# EAGLE board C10450-01 (EAGLE 6.6.0), part 1 of 2
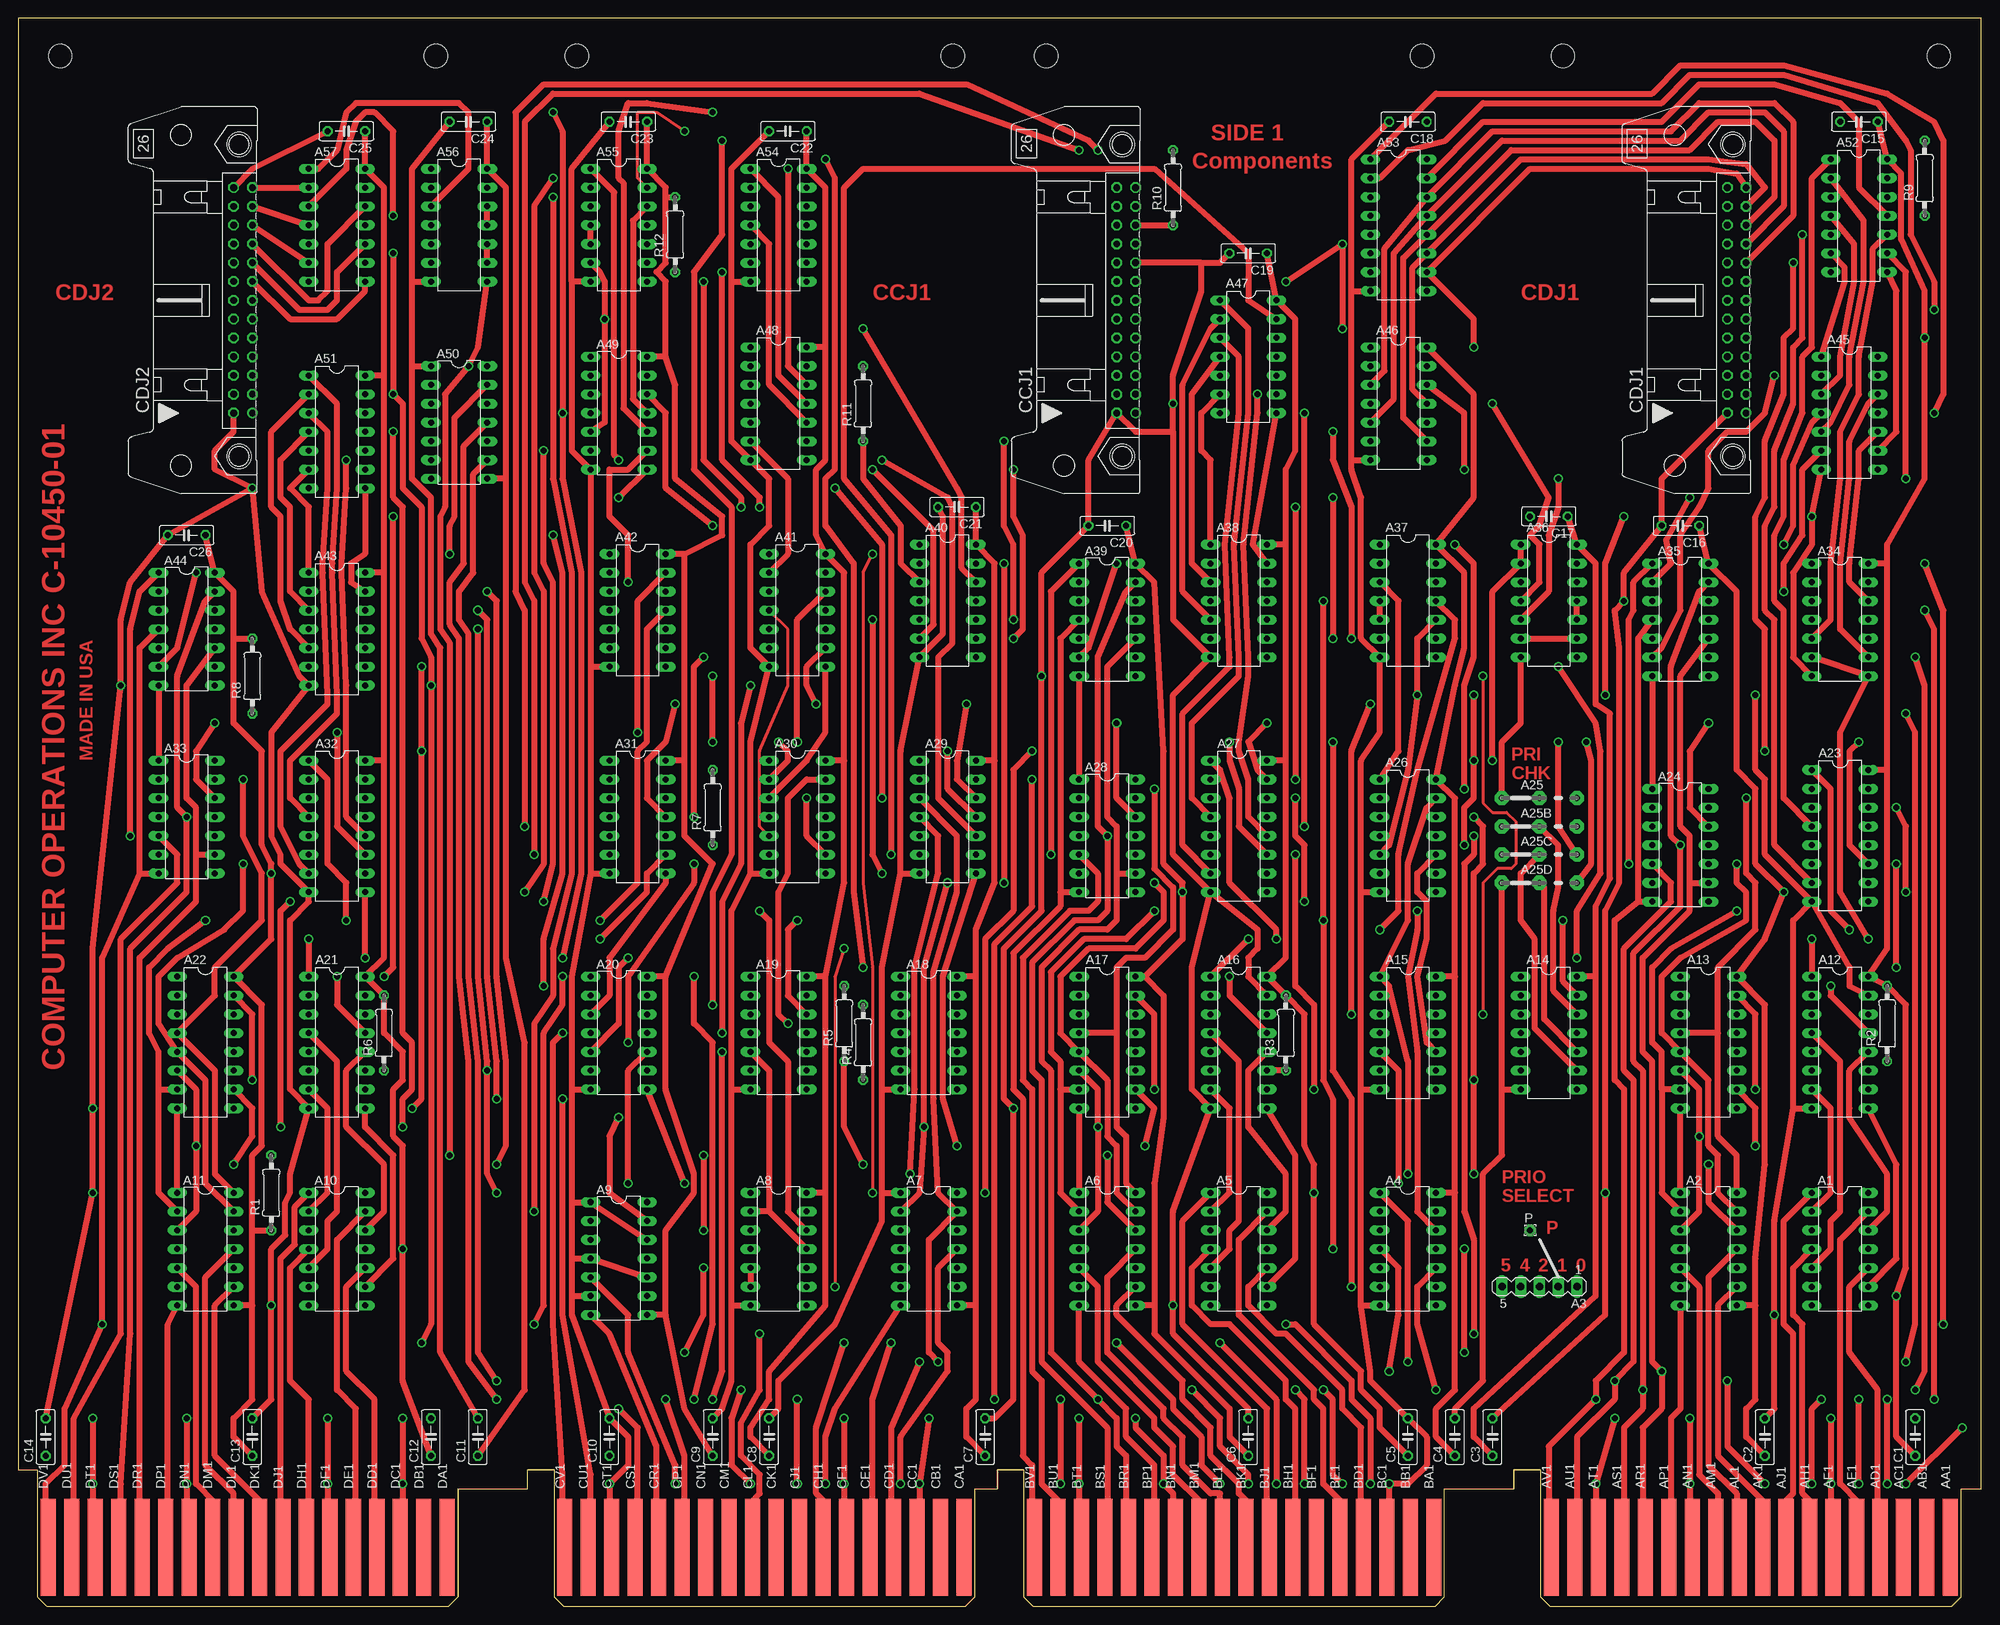
[diagram p3: board, top side]
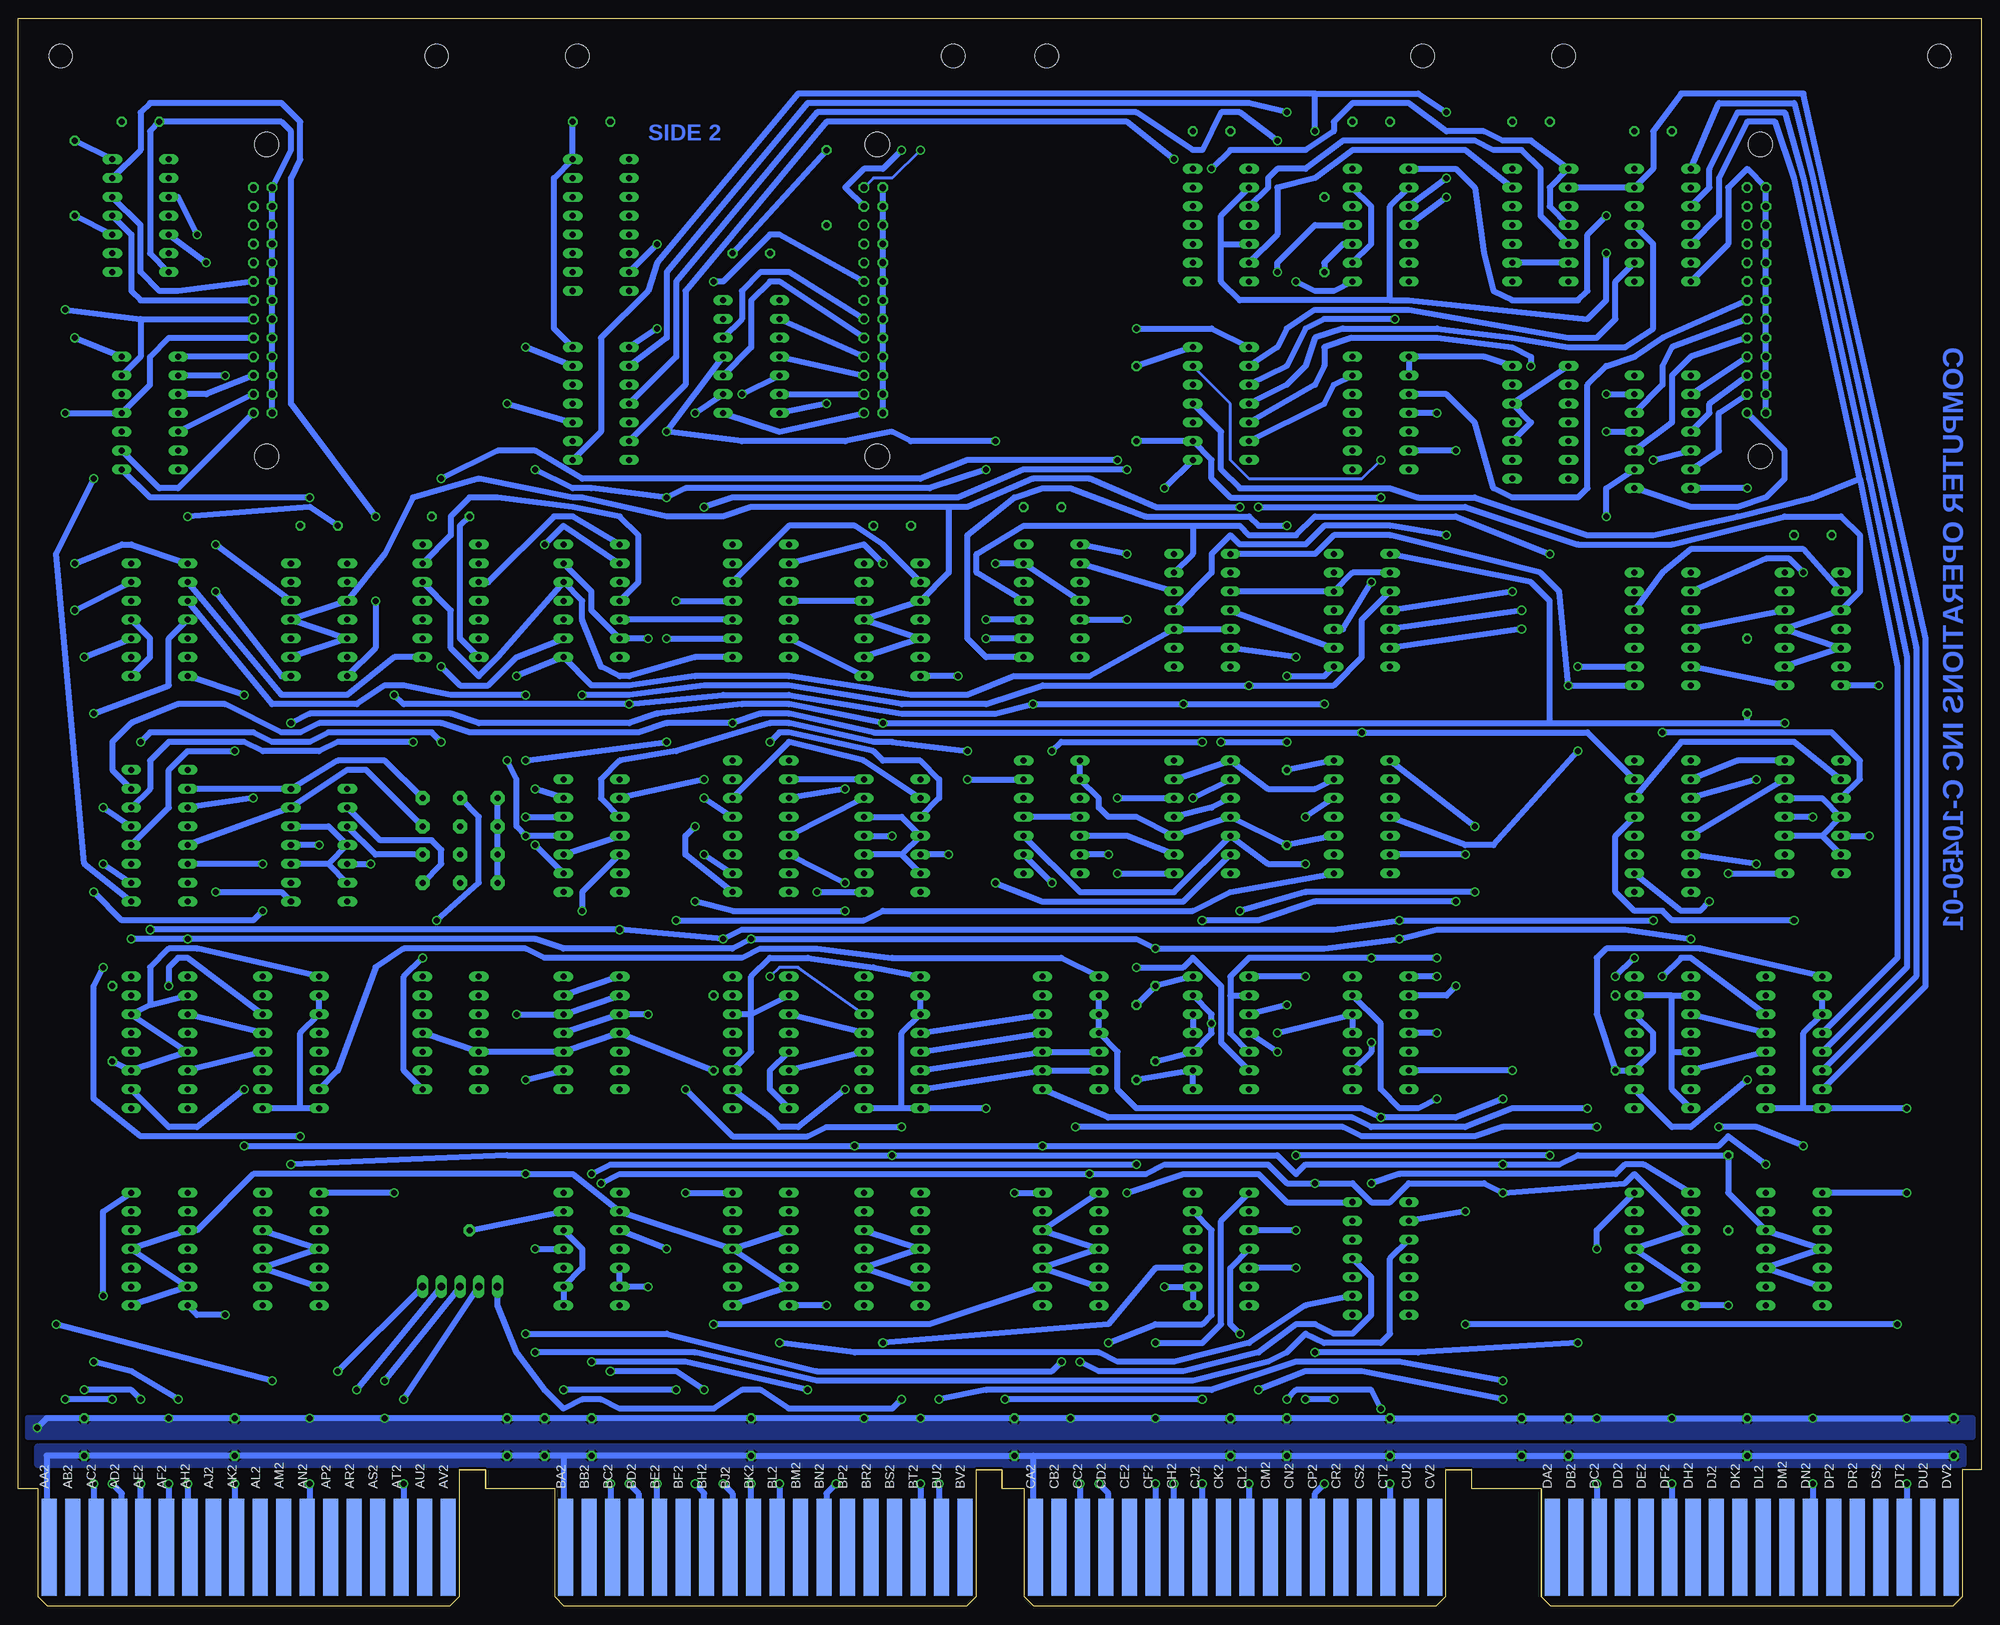
[diagram p4: board, bottom side, seen from below]

Size 265.3 x 214.63 mm. Coordinates in mm from the lower left corner, seen from the top.
Copper layers (1+2+16): Top 0.035mm / dielectric 1.5mm / Route2 0.035mm / dielectric 0.15mm / Bottom 0.035mm
Design rules "16mils": minimum track width 16mil, minimum drill 32mil, track to track 15mil, track to pad 10mil, pad to pad 10mil, via to via 10mil, smd to smd 10mil, copper to edge 13mil, drill to drill 10mil, minimum pad ring 10mil, minimum via ring 8mil, stop-mask expansion 0mil, vias tented up to drill 0mil, thermal gap 10mil
Net classes: 1 supply: width 0.813 mm

## Footprints (pad centres in the part's own frame; a part is rotated, then mirrored left to right if it is on the bottom)
DIL14 = drill 0.813 long: 1 -7.62,-3.81; 2 -5.08,-3.81; 3 -2.54,-3.81; 4 0,-3.81; 5 2.54,-3.81; 6 5.08,-3.81; 7 7.62,-3.81; 8 7.62,3.81; 9 5.08,3.81; 10 2.54,3.81; 11 0,3.81; 12 -2.54,3.81; 13 -5.08,3.81; 14 -7.62,3.81
MA05-1 = drill 1.016 long: 1 -5.08,0; 2 -2.54,0; 3 0,0; 4 2.54,0; 5 5.08,0
DIL16 = drill 0.813 long: 1 -8.89,-3.81; 2 -6.35,-3.81; 3 -3.81,-3.81; 4 -1.27,-3.81; 5 1.27,-3.81; 6 3.81,-3.81; 7 6.35,-3.81; 8 8.89,-3.81; 9 8.89,3.81; 10 6.35,3.81; 11 3.81,3.81; 12 1.27,3.81; 13 -1.27,3.81; 14 -3.81,3.81; 15 -6.35,3.81; 16 -8.89,3.81
05C = drill 0.813 pad 1.905 octagon: 1 -2.54,0; 2 2.54,0; 3 7.62,0
C050-025X075 = drill 0.813 octagon: 1 -2.54,0; 2 2.54,0
26H = drill 0.914: 1 -15.24,-1.27 | drill 0.914 octagon: 2 -15.24,1.27; 3 -12.7,-1.27; 4 -12.7,1.27; 5 -10.16,-1.27; 6 -10.16,1.27; 7 -7.62,-1.27; 8 -7.62,1.27; 9 -5.08,-1.27; 10 -5.08,1.27; 11 -2.54,-1.27; 12 -2.54,1.27; 13 0,-1.27; 14 0,1.27; 15 2.54,-1.27; 16 2.54,1.27; 17 5.08,-1.27; 18 5.08,1.27; 19 7.62,-1.27; 20 7.62,1.27; 21 10.16,-1.27; 22 10.16,1.27; 23 12.7,-1.27; 24 12.7,1.27; 25 15.24,-1.27; 26 15.24,1.27 | hole 3.302: -21.082,0.533; 21.082,0.533
1,6/0,8 = drill 0.813 pad 1.6 octagon: 1 0,0
0207/10 = drill 0.813 octagon: 1 -5.08,0; 2 5.08,0
OMNIBUS = hole 3.175: 208.915,209.55; 259.715,209.55; 189.865,209.55; 139.065,209.55; 75.616,209.55; 126.416,209.55; 56.566,209.55; 5.766,209.55
EDGE-CON8 = smd 2.032 x 13.106: AA1 261.303,7.938; AB1 258.127,7.938; AC1 254.952,7.938; AD1 251.778,7.938; AE1 248.602,7.938; AF1 245.428,7.938; AH1 242.252,7.938; AJ1 239.077,7.938; AK1 235.903,7.938; AL1 232.727,7.938; AM1 229.553,7.938; AN1 226.377,7.938; AP1 223.202,7.938; AR1 220.028,7.938; AS1 216.852,7.938; AT1 213.678,7.938; AU1 210.502,7.938; AV1 207.327,7.938; BA1 191.452,7.938; BB1 188.278,7.938; BC1 185.102,7.938; BD1 181.928,7.938; BE1 178.752,7.938; BF1 175.577,7.938; BH1 172.403,7.938; BJ1 169.227,7.938; BK1 166.053,7.938; BL1 162.877,7.938; BM1 159.702,7.938; BN1 156.528,7.938; BP1 153.352,7.938; BR1 150.178,7.938; BS1 147.002,7.938; BT1 143.827,7.938; BU1 140.653,7.938; BV1 137.477,7.938; CA1 127.953,7.938; CB1 124.778,7.938; CC1 121.603,7.938; CD1 118.427,7.938; CE1 115.252,7.938; CF1 112.078,7.938; CH1 108.903,7.938; CJ1 105.728,7.938; CK1 102.552,7.938; CL1 99.377,7.938; CM1 96.203,7.938; CN1 93.028,7.938; CP1 89.853,7.938; CR1 86.677,7.938; CS1 83.502,7.938; CT1 80.328,7.938; CU1 77.153,7.938; CV1 73.978,7.938; DA1 58.102,7.938; DB1 54.928,7.938; DC1 51.752,7.938; DD1 48.578,7.938; DE1 45.403,7.938; DF1 42.227,7.938; DH1 39.053,7.938; DJ1 35.877,7.938; DK1 32.703,7.938; DL1 29.527,7.938; DM1 26.352,7.938; DN1 23.177,7.938; DP1 20.003,7.938; DR1 16.828,7.938; DS1 13.652,7.938; DT1 10.477,7.938; DU1 7.303,7.938; DV1 4.128,7.938 | smd 2.032 x 13.106 bottom: AA2 261.303,7.938; AB2 258.127,7.938; AC2 254.952,7.938; AD2 251.778,7.938; AE2 248.602,7.938; AF2 245.428,7.938; AH2 242.252,7.938; AJ2 239.077,7.938; AK2 235.903,7.938; AL2 232.727,7.938; AM2 229.553,7.938; AN2 226.377,7.938; AP2 223.202,7.938; AR2 220.028,7.938; AS2 216.852,7.938; AT2 213.678,7.938; AU2 210.502,7.938; AV2 207.327,7.938; BA2 191.452,7.938; BB2 188.278,7.938; BC2 185.102,7.938; BD2 181.928,7.938; BE2 178.752,7.938; BF2 175.577,7.938; BH2 172.403,7.938; BJ2 169.227,7.938; BK2 166.053,7.938; BL2 162.877,7.938; BM2 159.702,7.938; BN2 156.528,7.938; BP2 153.352,7.938; BR2 150.178,7.938; BS2 147.002,7.938; BT2 143.827,7.938; BU2 140.653,7.938; BV2 137.477,7.938; CA2 127.953,7.938; CB2 124.778,7.938; CC2 121.603,7.938; CD2 118.427,7.938; CE2 115.252,7.938; CF2 112.078,7.938; CH2 108.903,7.938; CJ2 105.728,7.938; CK2 102.552,7.938; CL2 99.377,7.938; CM2 96.203,7.938; CN2 93.028,7.938; CP2 89.853,7.938; CR2 86.677,7.938; CS2 83.502,7.938; CT2 80.328,7.938; CU2 77.153,7.938; CV2 73.978,7.938; DA2 58.102,7.938; DB2 54.928,7.938; DC2 51.752,7.938; DD2 48.578,7.938; DE2 45.403,7.938; DF2 42.227,7.938; DH2 39.053,7.938; DJ2 35.877,7.938; DK2 32.703,7.938; DL2 29.527,7.938; DM2 26.352,7.938; DN2 23.177,7.938; DP2 20.003,7.938; DR2 16.828,7.938; DS2 13.652,7.938; DT2 10.477,7.938; DU2 7.303,7.938; DV2 4.128,7.938

## Placement (x,y rotation side)
A1  N8881N  [DIL14]  246.25,48.26 270 top
A2  SP380N  [DIL14]  228.47,48.26 270 top
A3  [MA05-1]  205.61,43.18 180 top
A4  N8881N  [DIL14]  187.83,48.26 270 top
A5  N8881N  [DIL14]  164.97,48.26 270 top
A6  SP380N  [DIL14]  147.19,48.26 270 top
A7  SP384N  [DIL14]  123.06,48.26 270 top
A8  N8881N  [DIL14]  102.74,48.26 270 top
A9  SP380N  [DIL14]  81.15,46.99 270 top
A10  N8881N  [DIL14]  43.05,48.26 270 top
A11  SP380N  [DIL14]  25.27,48.26 270 top
A12  74157N  [DIL16]  246.25,76.2 270 top
A13  74195N  [DIL16]  228.47,76.2 270 top
A14  N8815  [DIL14]  206.88,77.47 270 top
A15  74S74N  [DIL14]  187.83,77.47 270 top
A16  74157N  [DIL16]  164.97,76.2 270 top
A17  74195N  [DIL16]  147.19,76.2 270 top
A18  7430N  [DIL14]  123.06,77.47 270 top
A19  N8881N  [DIL14]  102.74,77.47 270 top
A20  N8881N  [DIL14]  81.15,77.47 270 top
A21  74157N  [DIL16]  43.05,76.2 270 top
A22  74195N  [DIL16]  25.27,76.2 270 top
A23  74157N  [DIL16]  246.25,104.14 270 top
A24  SP380N  [DIL14]  224.66,102.87 270 top
A25  [05C]  203.07,109.22 0 top
A25B  [05C]  203.07,105.41 0 top
A25C  [05C]  203.07,101.6 0 top
A25D  [05C]  203.07,97.79 0 top
A26  7474N  [DIL14]  187.83,104.14 270 top
A27  74157N  [DIL16]  164.97,105.41 270 top
A28  SP380N  [DIL14]  147.19,104.14 270 top
A29  74S11N  [DIL14]  125.6,106.68 270 top
A30  7474N  [DIL14]  105.28,106.68 270 top
A31  74S74N  [DIL14]  83.69,106.68 270 top
A32  74157N  [DIL16]  43.05,105.41 270 top
A33  SP380N  [DIL14]  22.73,106.68 270 top
A34  N8881N  [DIL14]  246.25,133.35 270 top
A35  N8881N  [DIL14]  224.66,133.35 270 top
A36  9002  [DIL14]  206.88,135.89 270 top
A37  7408N  [DIL14]  187.83,135.89 270 top
A38  7404N  [DIL14]  164.97,135.89 270 top
A39  N8881N  [DIL14]  147.19,133.35 270 top
A40  7410N  [DIL14]  125.6,135.89 270 top
A41  7408N  [DIL14]  105.28,134.62 270 top
A42  7402N  [DIL14]  83.69,134.62 270 top
A43  7404N  [DIL14]  43.05,132.08 270 top
A44  N8881N  [DIL14]  22.73,132.08 270 top
A45  7404N  [DIL14]  247.52,161.29 270 top
A46  7404N  [DIL14]  186.56,162.56 270 top
A47  7406N  [DIL14]  166.24,168.91 270 top
A48  7404N  [DIL14]  102.74,162.56 270 top
A49  7438N  [DIL14]  81.15,161.29 270 top
A50  SP380N  [DIL14]  59.56,160.02 270 top
A51  7406N  [DIL14]  43.05,158.75 270 top
A52  7406N  [DIL14]  248.79,187.96 270 top
A53  220/330  [DIL16]  186.56,186.69 270 top
A54  7408N  [DIL14]  102.74,186.69 270 top
A55  7408N  [DIL14]  81.15,186.69 270 top
A56  7410N  [DIL14]  59.56,186.69 270 top
A57  7406N  [DIL14]  43.05,186.69 270 top
C1  .01uF  [C050-025X075]  256.41,22.86 90 top
C2  .01uF  [C050-025X075]  236.09,22.86 90 top
C3  .01uF  [C050-025X075]  199.26,22.86 90 top
C4  .01uF  [C050-025X075]  194.18,22.86 90 top
C5  .01uF  [C050-025X075]  187.83,22.86 90 top
C6  .01uF  [C050-025X075]  166.24,22.86 90 top
C7  .01uF  [C050-025X075]  130.68,22.86 90 top
C8  .01uF  [C050-025X075]  101.47,22.86 90 top
C9  .01uF  [C050-025X075]  93.85,22.86 90 top
C10  .01uF  [C050-025X075]  79.88,22.86 90 top
C11  .01uF  [C050-025X075]  62.1,22.86 90 top
C12  .01uF  [C050-025X075]  55.75,22.86 90 top
C13  .01uF  [C050-025X075]  31.62,22.86 90 top
C14  .01uF  [C050-025X075]  3.68,22.86 90 top
C15  .01uF  [C050-025X075]  248.79,200.66 180 top
C16  .01uF  [C050-025X075]  224.66,146.05 180 top
C17  .01uF  [C050-025X075]  206.88,147.32 180 top
C18  .01uF  [C050-025X075]  187.83,200.66 180 top
C19  .01uF  [C050-025X075]  166.24,182.88 180 top
C20  .01uF  [C050-025X075]  147.19,146.05 180 top
C21  .01uF  [C050-025X075]  126.87,148.59 180 top
C22  .01uF  [C050-025X075]  104.01,199.39 180 top
C23  .01uF  [C050-025X075]  82.42,200.66 180 top
C24  .01uF  [C050-025X075]  60.83,200.66 180 top
C25  .01uF  [C050-025X075]  44.32,199.39 180 top
C26  .01uF  [C050-025X075]  22.73,144.78 180 top
CCJ1  [26H]  149.73,176.53 90 top
CDJ1  [26H]  232.28,176.53 90 top
CDJ2  [26H]  30.35,176.53 90 top
P  [1,6/0,8]  204.34,50.8 0 top
R1  390  [0207/10]  34.16,55.88 90 top
R2  1K  [0207/10]  252.6,78.74 90 top
R3  1K  [0207/10]  171.32,77.47 90 top
R4  1K  [0207/10]  114.17,76.2 90 top
R5  1K  [0207/10]  111.63,78.74 90 top
R6  1K  [0207/10]  49.4,77.47 90 top
R7  1K  [0207/10]  93.85,107.95 90 top
R8  390  [0207/10]  31.62,125.73 90 top
R9  1K  [0207/10]  257.68,193.04 90 top
R10  1K  [0207/10]  156.08,191.77 90 top
R11  1K  [0207/10]  114.17,162.56 90 top
R12  1K  [0207/10]  88.77,185.42 90 top
U$1  OUTLINE-OMNIBUS  [OMNIBUS]  -0.13,0 0 top
U$2  [EDGE-CON8]  -0.13,0 0 top

## Tracks (layer width: path | path; a pad name or v marks a point on that pad's centre or on a via)
!(676[13]+677[23])
  Top 0.813: A48.6 104.01,152.4 104.01,142.24 A41.2
  Bottom 0.813: A49.13 87.5,165.1 88.77,162.56 A48.6
!BINITIALIZE  (via drill 0.81)
  Top 0.813: A55.6 78.61,180.34 79.25,179.07 v79.25,173.99 79.25,160.02 A49.5
  Bottom 0.813: v79.25,173.99 88.77,173.99 91.31,172.72 93.85,167.64 A48.3
!BREAK_CYCLE  (via drill 0.81)
  Top 0.813: v162.43,16.51 159.89,19.05 159.89,22.86 156.08,26.67 156.08,27.94 v148.46,35.56
  Bottom 0.813: U$2.BL2 162.43,8.26 v162.43,16.51 | A8.10 111.63,45.72 117.98,38.1 v148.46,35.56
!BRK_DATA_CONT  (via drill 0.81)
  Top 0.813: v166.24,16.51 166.24,17.78 162.43,21.59 162.43,25.4 v158.62,29.21 | A4.1 187.83,52.07 v187.83,33.02
  Bottom 0.813: U$2.BK2 166.24,8.26 v166.24,16.51 | v187.83,33.02 175.13,33.02 v158.62,29.21
!BRK_IN_PROG  (via drill 0.81)
  Top 0.813: v191.64,29.21 189.1,38.1 189.1,43.18 A4.10 | v176.4,29.21 177.67,27.94 177.67,17.78 v178.94,16.51
  Bottom 0.813: v176.4,29.21 v191.64,29.21 | v178.94,16.51 178.94,8.26 U$2.BE2
!C0  (via drill 0.81)
  Top 0.813: U$2.CE1 115.44,8.26 115.44,27.94 v117.98,35.56
  Bottom 0.813: A8.13 104.01,50.8 104.01,39.37 105.28,38.1 111.63,38.1 v117.98,35.56
!C1  (via drill 0.81)
  Top 0.813: U$2.CH1 109.09,8.26 109.09,13.97 107.82,15.24 107.82,24.13 v111.63,35.56
  Bottom 0.813: A8.1 102.74,52.07 102.74,38.1 105.28,35.56 v111.63,35.56
!CA  (via drill 0.81)
  Top 0.813: v133.22,140.97 v133.22,97.79
  Bottom 0.813: A30.6 107.82,95.25 126.87,95.25 v133.22,97.79 | v133.22,140.97 A40.13 A40.4
!CDJ1P25  (via drill 0.81)
  Top 0.813: v134.49,130.81 135.76,132.08 135.76,144.78 134.49,147.32 v134.49,153.67 | A46.12 195.45,161.29 v195.45,153.67 | v177.67,149.86 v177.67,130.81
  Bottom 0.813: v195.45,153.67 190.37,151.13 187.83,151.13 v177.67,149.86 175.13,151.13 142.11,151.13 v134.49,153.67 | A40.9 v134.49,130.81 | v177.67,130.81 A38.9
!CPMA_DISABLE  (via drill 0.81)
  Top 0.813: U$2.CU1 77.34,8.26 77.34,17.78 73.53,39.37 v73.53,68.58
  Bottom 0.813: A20.13 81.15,78.74 81.15,69.85 78.61,67.31 76.07,67.31 v73.53,68.58
!DATA0  (via drill 0.81)
  Top 0.813: U$2.AR1 219.58,8.26 219.58,24.13 222.12,26.67 v222.12,31.75 220.85,33.02 220.85,73.66 219.58,74.93 219.58,87.63 225.93,93.98 225.93,97.79 | 225.93,97.79 A24.9 | A35.10 224.66,125.73 224.66,105.41 225.93,104.14 225.93,97.79
  Bottom 0.813: A3.1 v222.12,31.75
!DATA1  (via drill 0.81)
  Top 0.813: A35.13 227.2,137.16 223.39,127 223.39,104.14 v224.66,102.87 224.66,94.61 218.31,88.27 218.31,73.66 219.58,72.39 v219.58,29.21 219.58,26.67 217.04,24.13 217.04,8.26 U$2.AS1
  Bottom 0.813: v219.58,29.21 A3.2 | v224.66,102.87 A24.11
!DATA2  (via drill 0.81)
  Top 0.813: U$2.AU1 210.69,8.26 210.69,22.86 215.77,27.94 v215.77,30.48 218.31,33.02 218.31,71.12 217.04,72.39 217.04,88.9 223.39,95.25 223.39,97.79 A24.5 | A35.1 218.31,138.43 218.31,134.62 217.68,133.35 v217.68,100.33
  Bottom 0.813: v215.77,30.48 A3.3 | A24.5 v217.68,100.33
!DATA3  (via drill 0.81)
  Top 0.813: U$2.AV1 206.88,8.26 206.88,21.59 v213.23,27.94 213.23,30.48 217.04,34.29 217.04,69.85 215.77,71.12 215.77,92.71 218.95,95.25 | A24.7 219.58,95.25 218.95,95.25 | A35.4 218.95,130.81 218.95,95.25
  Bottom 0.813: v213.23,27.94 A3.4
!DATA4  (via drill 0.81)
  Top 0.813: U$2.BR1 149.73,8.26 149.73,20.32 148.46,21.59 148.46,25.4 v145.92,27.94 139.57,34.29 139.57,72.39 138.3,73.66 138.3,86.36 143.38,91.44 147.19,91.44 148.46,92.71 148.46,99.06 | 148.46,99.06 A28.9 | 148.46,99.06 148.46,105.41 147.19,106.68 147.19,127 A39.10
  Bottom 0.813: A3.5 200.53,40.64 197.99,34.29 194.18,29.21 191.64,26.67 189.1,27.94 186.56,27.94 184.02,26.67 171.32,26.67 167.51,29.21 164.97,29.21 161.16,26.67 147.19,26.67 v145.92,27.94
!DATA5  (via drill 0.81)
  Top 0.813: U$2.BS1 147.19,8.26 147.19,24.13 138.3,33.02 138.3,71.12 137.03,72.39 137.03,87 142.75,92.71 145.92,92.71 147.19,93.98 v147.19,104.14 145.92,105.41 145.92,128.27 149.73,137.16 A39.13
  Bottom 0.813: A28.11 v147.19,104.14
!DATA6  (via drill 0.81)
  Top 0.813: U$2.BU1 140.84,8.26 140.84,13.97 138.3,16.51 138.3,30.48 137.03,31.75 137.03,69.85 135.76,71.12 135.76,87.63 142.11,93.98 144.65,93.98 145.92,95.25 145.92,99.06 A28.5 | A39.1 139.57,137.16 v139.57,101.6
  Bottom 0.813: v139.57,101.6 A28.5
!DATA7
  Top 0.813: U$2.BV1 137.03,8.26 137.03,19.05 135.76,20.32 135.76,68.58 134.49,69.85 134.49,88.27 140.84,94.61 140.84,96.52 | 140.84,96.52 A28.7 | A39.4 140.84,130.81 140.84,96.52
!DATA8
  Top 0.813: U$2.DR1 16.38,8.26 16.38,87.63 24,95.25 24,101.6 | 24,101.6 A33.9 | 24,101.6 24,107.95 22.73,109.22 22.73,124.46 A44.10
!DATA9  (via drill 0.81)
  Top 0.813: U$2.DS1 13.84,8.26 13.84,16.51 15.11,36.83 15.11,88.9 22.73,96.52 v22.73,106.68 21.46,107.95 21.46,125.73 25.27,135.89 A44.13
  Bottom 0.813: v22.73,106.68 A33.11
!DATA10  (via drill 0.81)
  Top 0.813: U$2.DU1 7.49,8.26 7.49,25.4 13.84,36.83 13.84,90.17 21.46,97.79 21.46,101.6 A33.5 | v15.11,104.14 15.11,132.08 16.38,137.16 A44.1
  Bottom 0.813: A33.5 v15.11,104.14
!DATA11  (via drill 0.81)
  Top 0.813: U$2.DV1 3.68,8.26 3.68,16.51 6.22,19.05 6.22,26.67 v11.3,38.1 11.3,87.63 16.38,99.06 | A44.4 16.38,129.54 16.38,99.06 | 16.38,99.06 A33.7 | v69.72,38.1 70.99,40.64 70.99,77.47 73.53,81.28 v73.53,85.09
  Bottom 0.813: v11.3,38.1 v69.72,38.1 | v73.53,85.09 A20.1
!EMA0  (via drill 0.81)
  Top 0.813: v252.6,16.51 v252.6,27.94 | v258.95,27.94 258.95,132.08 v257.68,134.62
  Bottom 0.813: U$2.AD2 251.33,8.26 251.33,15.24 v252.6,16.51 | v252.6,27.94 v258.95,27.94 | v257.68,134.62 A34.13
!EMA1  (via drill 0.81)
  Top 0.813: v248.79,16.51 v248.79,27.94 | v256.41,29.21 257.68,31.75 257.68,124.46 v256.41,128.27
  Bottom 0.813: U$2.AE2 248.79,8.26 v248.79,16.51 | v248.79,27.94 250.06,29.21 v256.41,29.21 | v256.41,128.27 A34.10
!EMA2  (via drill 0.81)
  Top 0.813: v242.44,16.51 242.44,26.67 v243.71,27.94 | v255.14,33.02 256.41,38.1 256.41,118.11 v255.14,120.65
  Bottom 0.813: U$2.AH2 242.44,8.26 v242.44,16.51 | v243.71,27.94 250.06,31.75 v255.14,33.02 | A34.4 244.98,130.81 244.98,124.46 v255.14,120.65
!INITIALIZE  (via drill 0.81)
  Top 0.813: v69.72,53.34 69.72,78.74 72.26,82.55 72.26,88.9 74.8,99.06 74.8,139.7 72.26,152.4 v72.26,190.5 | A55.5 A55.4
  Bottom 0.813: v69.72,53.34 A9.2 | A55.4 v72.26,190.5
!INT_RQST  (via drill 0.81)
  Top 0.813: U$2.CP1 90.04,8.26 90.04,20.32 v87.5,27.94 | v91.31,27.94 93.85,38.1 93.85,76.2 91.31,78.74 v91.31,85.09
  Bottom 0.813: v87.5,27.94 v91.31,27.94 | v91.31,85.09 A19.1
!INTERNAL_IO  (via drill 0.81)
  Top 0.813: U$2.CL1 98.93,8.26 98.93,13.97 100.2,15.24 100.2,17.78 97.66,20.32 97.66,24.77 100.2,29.21 v100.2,36.83
  Bottom 0.813: A8.4 101.47,45.72 101.47,38.1 v100.2,36.83
!IO_PAUSE  (via drill 0.81)
  Top 0.813: U$2.CD1 117.98,8.26 117.98,24.13 v121.79,33.02
  Bottom 0.813: v121.79,33.02 119.25,31.75 107.82,31.75 97.66,34.29 92.58,38.1 90.04,38.1 87.5,36.83 84.96,36.83 82.42,39.37 82.42,44.45 A9.11
!IOD00
  Top 0.813: A45.5 244.98,160.02 247.52,165.1 247.52,168.91 249.43,179.07 249.43,187.32 A52.2
  Bottom 0.813: CDJ1.3 A45.5
!IOD01
  Top 0.813: A45.3 246.25,166.37 246.25,168.91 248.16,179.07 248.16,184.15 A52.4
  Bottom 0.813: A45.3 239.9,163.83 CDJ1.5
!IOD02
  Top 0.813: A52.8 253.87,177.8 253.87,158.75 A45.9
  Bottom 0.813: A45.9 246.25,151.13 243.71,151.13 CDJ1.1
!IOD03
  Top 0.813: A45.1 246.89,179.07 246.89,180.97 A52.6
  Bottom 0.813: CDJ1.7 A45.1
!IOD04
  Top 0.813: A47.2 161.16,172.72 157.35,165.1 157.35,137.16 A38.5
  Bottom 0.813: A47.2 CCJ1.7
!IOD05
  Top 0.813: A47.4 158.62,163.83 158.62,140.97 A38.3
  Bottom 0.813: A47.4 CCJ1.5
!IOD06
  Top 0.813: A47.8 166.88,143.51 A38.13
  Bottom 0.813: A47.8 162.43,158.75 CCJ1.1
!IOD07
  Top 0.813: A47.6 159.89,161.29 159.89,156.21 161.16,154.94 A38.1
  Bottom 0.813: A47.6 CCJ1.3
!IOD08
  Top 0.813: A43.5 36.7,132.08 35.43,135.89 35.43,147.32 34.16,148.59 34.16,158.75 A51.2
  Bottom 0.813: A51.2 CDJ2.7
!IOD09
  Top 0.813: A51.4 35.43,154.94 35.43,149.86 36.7,148.59 36.7,137.16 A43.3
  Bottom 0.813: CDJ2.5 36.7,162.56 36.7,161.29 A51.4
!IOD10
  Top 0.813: A51.8 46.86,142.24 44.96,140.97 44.96,138.43 A43.13
  Bottom 0.813: CDJ2.1 26.54,156.21 26.54,152.4 29.08,149.86 32.89,148.59 39.24,148.59 A51.8
!IOD11
  Top 0.813: A51.6 36.7,151.13 39.24,148.59 A43.1
  Bottom 0.813: CDJ2.3 35.43,161.29 35.43,156.21 A51.6
!LOAD_CONT  (via drill 0.81)
  Top 0.813: v173.86,16.51 173.86,27.94 v172.59,29.21 | v185.29,31.75 186.56,39.37 186.56,45.72 A4.4
  Bottom 0.813: U$2.BH2 172.59,8.26 172.59,15.24 v173.86,16.51 | v185.29,31.75 176.4,31.75 v172.59,29.21
!MA00
  Top 0.813: U$2.AD1 251.33,8.26 251.33,29.21 247.52,34.29 247.52,43.18 A1.10
!MA01
  Top 0.813: U$2.AE1 248.79,8.26 248.79,13.97 246.25,16.51 246.25,49.53 A1.13
!MA02
  Top 0.813: U$2.AH1 242.44,8.26 242.44,13.97 241.17,15.24 241.17,38.1 239.9,39.37 239.9,45.72 A1.4
!MA03
  Top 0.813: A1.1 238.63,52.07 238.63,38.1 239.9,36.83 239.9,15.24 238.63,13.97 238.63,8.26 U$2.AJ1
!MA04
  Top 0.813: U$2.BD1 181.48,8.26 181.48,24.13 178.94,26.67 178.94,29.21 171.32,36.83 170.05,36.83 166.24,40.64 166.24,43.18 A5.10
!MA05
  Top 0.813: U$2.BE1 178.94,8.26 178.94,13.97 176.4,16.51 176.4,26.67 175.13,27.94 175.13,29.21 164.97,39.37 164.97,49.53 A5.13
!MA06
  Top 0.813: U$2.BH1 172.59,8.26 172.59,26.67 171.32,27.94 171.32,30.48 163.7,38.1 161.16,38.1 158.62,40.64 158.62,45.72 A5.4
!MA07
  Top 0.813: U$2.BJ1 168.78,8.26 168.78,26.67 157.35,38.1 157.35,52.07 A5.1
!MA08
  Top 0.813: U$2.DD1 48.13,8.26 48.13,27.94 44.32,31.75 44.32,43.18 A10.10
!MA09
  Top 0.813: U$2.DE1 45.59,8.26 45.59,26.67 43.05,29.21 43.05,49.53 A10.13
!MA10
  Top 0.813: U$2.DH1 39.24,8.26 39.24,27.94 36.7,30.48 36.7,45.72 A10.4
!MA11  (via drill 0.81)
  Top 0.813: U$2.DJ1 35.43,8.26 35.43,46.99 37.34,48.9 37.34,53.98 A10.1 | A20.10 82.42,72.39 v82.42,57.15
  Bottom 0.813: A10.1 45.59,59.69 48.13,59.69 49.4,58.42 78.61,58.42 v82.42,57.15
!MD00
  Top 0.813: U$2.AK1 236.09,8.26 236.09,13.97 229.74,20.32 229.74,40.64 A2.9
!MD01
  Top 0.813: U$2.AL1 232.28,8.26 232.28,15.24 228.47,19.05 228.47,44.45 A2.11
!MD02
  Top 0.813: U$2.AM1 229.74,8.26 229.74,15.24 227.2,17.78 227.2,43.18 A2.5
!MD03
  Top 0.813: U$2.AP1 223.39,8.26 223.39,25.4 224.66,26.67 A2.7
!MD04
  Top 0.813: U$2.BK1 166.24,8.26 166.24,13.97 164.97,15.24 164.97,16.51 161.16,20.32 161.16,24.13 157.35,27.94 157.35,30.48 148.46,39.37 148.46,40.64 A6.9
!MD05
  Top 0.813: U$2.BL1 162.43,8.26 162.43,15.24 161.16,15.24 157.35,19.05 157.35,22.86 154.81,25.4 154.81,26.67 147.19,34.29 147.19,44.45 A6.11
!MD06
  Top 0.813: U$2.BM1 159.89,8.26 159.89,13.97 156.08,17.78 156.08,21.59 153.54,24.13 153.54,25.4 145.92,33.02 145.92,43.18 A6.5
!MD07
  Top 0.813: U$2.BP1 153.54,8.26 153.54,19.05 149.73,22.86 149.73,26.67 143.38,33.02 A6.7
!MD08
  Top 0.813: U$2.DK1 32.89,8.26 32.89,13.97 26.54,20.32 26.54,40.64 A11.9
!MD09
  Top 0.813: U$2.DL1 29.08,8.26 29.08,15.24 25.27,19.05 25.27,44.45 A11.11
!MD10
  Top 0.813: U$2.DM1 26.54,8.26 26.54,13.97 24,16.51 24,43.18 A11.5
!MD11
  Top 0.813: U$2.DP1 20.19,8.26 20.19,38.1 A11.7
!MD_DIR  (via drill 0.81)
  Top 0.813: v236.09,16.51 231.01,21.59 v231.01,30.48 | v260.22,38.1 260.22,134.62 v257.68,140.97
  Bottom 0.813: U$2.AK2 236.09,8.26 v236.09,16.51 | v231.01,30.48 v260.22,38.1 | A34.1 250.06,143.51 251.33,143.51 v257.68,140.97
!MS_DISABLE  (via drill 0.81)
  Top 0.813: U$2.CV1 73.53,8.26 73.53,17.78 72.26,38.1 72.26,76.2 v73.53,77.47
  Bottom 0.813: v73.53,77.47 A20.4
!MY_IOT  (via drill 0.81)
  Top 0.813: v53.21,67.31 54.48,68.58 v54.48,115.57 v54.48,127
  Bottom 0.813: A31.4 69.72,102.87 65.91,102.87 v54.48,115.57 | A18.8 117.98,66.04 84.96,66.04 82.42,64.77 69.72,64.77 63.37,67.31 v53.21,67.31 | v54.48,127 A43.9
!OVERFLOW  (via drill 0.81)
  Top 0.813: v170.05,16.51 170.05,27.94 v162.43,35.56
  Bottom 0.813: U$2.BJ2 168.78,8.26 168.78,15.24 v170.05,16.51 | v162.43,35.56 152.27,34.29 119.25,34.29 116.71,33.02 109.09,33.02 98.93,35.56 91.31,40.64 A9.9
!RUN  (via drill 0.81)
  Top 0.813: v140.84,27.94 v140.84,16.51 | v64.64,30.48 62.1,34.29 62.1,73.66 60.83,85.09 60.83,131.44 59.56,133.35 59.56,137.16 61.47,139.7 61.47,153.03 A50.9
  Bottom 0.813: U$2.BU2 140.84,8.26 v140.84,16.51 | v64.64,30.48 78.61,33.02 92.58,33.02 104.01,29.21 134.49,29.21 v140.84,27.94
!SKIP  (via drill 0.81)
  Top 0.813: U$2.CS1 83.69,8.26 83.69,24.13 v81.15,26.67 | v93.85,27.94 95.12,31.75 v95.12,74.93
  Bottom 0.813: v81.15,26.67 82.42,29.21 92.58,29.21 v93.85,27.94 | v95.12,74.93 A19.4
!STOP_DMA  (via drill 0.81)
  Top 0.813: v194.18,143.51 196.72,140.97 196.72,128.27 195.45,124.46 v195.45,110.49 | A26.13 190.37,107.95 187.83,100.33 187.83,92.71 A15.1 185.29,83.82 187.83,73.66 v187.83,58.42 | v114.17,59.69 111.63,64.77 R5.1 | v104.01,78.74 102.74,80.01 102.74,96.52 104.01,99.06 104.01,109.22 106.55,111.76 A30.13
  Bottom 0.813: A26.13 v195.45,110.49 | A37.2 191.64,146.05 v194.18,143.51 | A15.1 A15.13 | v187.83,58.42 185.29,59.69 v114.17,59.69 | R5.1 A19.10 104.01,77.47 v104.01,78.74 104.01,80.01 A19.13 | A30.13 A30.1 96.39,110.49 90.04,110.49 A31.13
!TP4  (via drill 0.81)
  Top 0.813: v88.77,121.92 87.5,116.84 84.96,114.3 84.96,109.22 A31.11 | v107.82,121.92 106.55,124.46 106.55,127 A41.9 | v128.14,121.92 126.87,114.3 126.87,111.76 A29.12 | v214.5,123.19 214.5,140.97 v217.04,147.32 | v182.75,121.92 180.21,115.57 v180.21,80.01
  Bottom 0.813: v217.04,147.32 228.47,162.56 228.47,193.04 227.2,195.58 227.2,200.66 229.74,203.2 247.52,203.2 248.79,201.93 248.79,196.85 A52.13 | v88.77,121.92 v107.82,121.92 v128.14,121.92 133.22,120.65 145.92,120.65 161.16,123.19 170.05,123.19 v182.75,121.92 213.23,121.92 v214.5,123.19 | A15.11 A15.3 v180.21,80.01
!TS2  (via drill 0.81)
  Top 0.813: v98.93,16.51 96.39,19.05 96.39,25.4 v97.66,29.21 | v64.64,27.94 60.83,33.02 60.83,73.66 59.56,85.09 59.56,130.81 58.29,132.72 58.29,138.43 60.2,140.97 60.2,156.84 A50.11
  Bottom 0.813: U$2.CL2 98.93,8.26 v98.93,16.51 | v64.64,27.94 83.69,31.75 91.31,31.75 v97.66,29.21
!TS4  (via drill 0.81)
  Top 0.813: v88.77,16.51 88.77,19.05 82.42,34.29 82.42,39.37 A9.5
  Bottom 0.813: U$2.CP2 90.04,8.26 90.04,15.24 v88.77,16.51
!WANT_MUX  (via drill 0.81)
  Top 0.813: v168.78,119.38 166.24,116.84 167.51,113.03 A27.15 | A42.13 83.69,135.89 v83.69,118.11
  Bottom 0.813: A32.15 53.21,118.11 v83.69,118.11 149.73,118.11 161.16,120.65 164.97,120.65 v168.78,119.38 177.67,119.38 181.48,118.11 204.34,118.11 208.15,119.38 224.66,119.38 227.2,118.11 229.74,118.11 237.36,121.92 243.71,121.92 250.06,119.38 252.6,116.84 252.6,113.03 A23.15
!WC  (via drill 0.81)
  Top 0.813: v116.71,99.06 115.44,101.6 v115.44,133.35
  Bottom 0.813: v116.71,99.06 A30.8 | A40.5 v115.44,133.35
!XEMA0  (via drill 0.81)
  Top 0.813: v258.95,161.29 260.22,163.83 260.22,198.12 258.95,200.66 252.6,204.47 238.63,208.28 224.66,208.28 220.85,204.47 191.64,204.47 A53.1
  Bottom 0.813: v258.95,161.29 A45.11 247.52,165.1 247.52,168.91 244.98,171.45 CDJ1.9
!XEMA1  (via drill 0.81)
  Top 0.813: v258.95,175.26 258.95,179.07 255.78,185.42 255.78,196.85 255.14,198.12 251.33,203.2 238.63,207.01 225.93,207.01 222.12,203.2 197.99,203.2 192.91,198.12 187.83,196.85 184.02,193.04 A53.2
  Bottom 0.813: A45.13 248.79,168.91 248.79,173.99 | 248.79,173.99 CDJ1.11 | v258.95,175.26 248.79,173.99
!XEMA2
  Top 0.813: A53.15 197.99,200.66 222.12,200.66 227.2,205.74 237.36,205.74 246.25,203.2 248.79,200.66 248.79,191.77 A52.11
  Bottom 0.813: A52.11 250.06,185.42 250.06,177.8 248.79,176.53 CDJ1.13
+3VA
  Top 0.813: R3.1 A16.11 | A26.10 189.1,99.06 189.1,96.52 190.37,95.25 190.37,90.17 189.1,85.09 190.37,76.2 A15.10
  Bottom 0.813: A14.11 A14.5 A15.10 A15.4 R3.1 | A16.11 166.24,74.93 166.24,80.01 | 166.24,80.01 A16.14 | 166.24,80.01 A16.2 | 166.24,80.01 166.24,85.09 163.7,87.63 158.62,87.63 149.73,86.36 A17.1 | A26.10 A26.4
+3VB
  Bottom 0.813: A21.14 44.32,77.47 44.32,74.93 A21.11 R6.1 51.94,80.01 51.94,87.63 50.67,88.9 37.97,88.9 A22.1
+3VC
  Bottom 0.813: 247.52,81.28 A12.2 | 247.52,81.28 A12.14 A12.5 A12.11 R2.1 | A13.1 241.17,88.9 244.98,88.9 247.52,86.36 247.52,81.28
+3VD
  Bottom 0.813: A31.10 R7.1 A30.4 A30.10 114.17,106.68 117.98,106.68 119.25,107.95 119.25,109.22 A29.2 A29.1
ADDR00  (via drill 0.81)
  Top 0.813: A13.15 234.82,80.01 v234.82,69.85
  Bottom 0.813: v234.82,69.85 241.17,64.77 244.98,64.77 A12.10
ADDR01  (via drill 0.81)
  Top 0.813: A12.13 244.98,82.55 v244.98,83.82
  Bottom 0.813: A13.14 242.44,87.63 243.71,87.63 244.98,86.36 v244.98,83.82
ADDR02
  Bottom 0.813: A13.13 A12.3
ADDR03
  Bottom 0.813: A13.12 A12.6
ADDR04  (via drill 0.81)
  Top 0.813: A17.15 153.54,80.01 v153.54,69.85
  Bottom 0.813: A16.10 163.7,66.04 162.43,64.77 159.89,64.77 v153.54,69.85
ADDR05  (via drill 0.81)
  Top 0.813: A16.13 163.7,82.55 v163.7,85.09
  Bottom 0.406: A17.14 159.89,86.36 162.43,86.36 v163.7,85.09
ADDR06
  Bottom 0.813: A17.13 A16.3
ADDR07
  Bottom 0.813: A17.12 A16.6
ADDR08  (via drill 0.81)
  Top 0.813: A22.15 31.62,80.01 v31.62,71.12
  Bottom 0.813: A21.10 41.78,64.77 39.24,64.77 v31.62,71.12
ADDR09  (via drill 0.81)
  Top 0.813: A21.13 43.05,81.28 v43.05,85.09
  Bottom 0.813: A22.14 39.24,87.63 40.51,87.63 v43.05,85.09
ADDR10
  Bottom 0.813: A22.13 A21.3
ADDR11
  Bottom 0.813: A22.12 A21.6
ADDR/!WC  (via drill 0.81)
  Top 0.406: v110.36,43.18 110.36,85.09 v111.63,88.9
  Top 0.813: v39.24,90.17 A21.1 | v78.61,90.17 84.96,96.52 84.96,99.06 A31.9 | v166.24,90.17 A16.1 | v250.06,90.17 246.25,96.52 246.25,118.11 A34.8 A34.6 | v242.44,90.17 A12.1
  Bottom 0.813: v250.06,90.17 v242.44,90.17 195.45,90.17 191.64,88.9 168.78,88.9 v166.24,90.17 114.17,90.17 v111.63,88.9 88.77,88.9 v78.61,90.17 73.53,91.44 48.13,91.44 v39.24,90.17 | A8.8 A8.9 v110.36,43.18 | A34.11 247.52,130.81 247.52,128.27 A34.8
BADDR  (via drill 0.81)
  Top 0.813: v180.21,130.81 180.21,148.59 177.67,154.94 v177.67,158.75 | v134.49,133.35 134.49,143.51 133.22,146.05 v133.22,157.48
  Bottom 0.813: v180.21,130.81 A37.6 187.83,134.62 187.83,137.16 A37.13 | A40.10 v134.49,133.35 | A47.11 v177.67,158.75 167.51,157.48 153.54,157.48 147.19,158.75 144.65,157.48 v133.22,157.48
BCDJ1P25
  Bottom 0.813: A38.8 173.86,128.27 182.75,125.73 184.02,125.73 186.56,127 189.1,133.35 189.1,135.89 A37.12 200.53,128.27 203.07,125.73 206.88,129.54 206.88,134.62 A36.12
BTP1  (via drill 0.81)
  Top 0.813: v196.72,104.14 196.72,101.6 195.45,100.33 195.45,53.34 196.72,49.53 v196.72,36.83 | v199.26,114.3 199.26,137.16 A36.2 A36.1 | v124.33,33.02 123.06,34.29 123.06,49.53 A7.13 124.33,55.88 123.7,68.58 123.7,85.72 126.87,96.52 126.87,104.14 A29.3
  Bottom 0.813: A26.11 v196.72,104.14 197.99,105.41 197.99,111.76 v199.26,114.3 | v196.72,36.83 177.67,36.83 157.35,31.75 125.6,31.75 v124.33,33.02
BTP3  (via drill 0.81)
  Top 0.813: v125.6,97.79 122.43,86.36 v122.43,64.77 121.79,55.88 A7.2 | v51.94,64.77 51.94,68.58 53.21,69.85 53.21,76.2 51.94,77.47 51.94,148.59 50.67,149.86 v50.67,158.75
  Bottom 0.813: v122.43,64.77 86.23,64.77 83.69,63.5 68.45,63.5 64.64,64.77 v51.94,64.77 | v50.67,158.75 A51.11 | v125.6,97.79 A29.9
CA  (via drill 0.81)
  Top 0.406: A41.4 104.01,132.08 104.01,124.46 100.2,115.57 100.2,105.41 A30.5
  Top 0.813: A36.5 206.88,137.16 206.88,144.78 208.15,148.59 v208.15,152.4 | v116.71,154.94 125.6,149.86 126.24,148.59 126.24,130.18 124.33,128.27 124.33,109.22 A29.10 | v91.31,100.33 91.31,97.79 82.42,85.09 v82.42,76.2
  Bottom 0.813: A20.9 82.42,74.93 v82.42,76.2 | v208.15,152.4 200.53,156.21 195.45,156.21 189.1,152.4 143.38,152.4 137.03,154.94 v116.71,154.94 | A29.10 121.79,96.52 109.09,96.52 A30.5 96.39,100.33 v91.31,100.33 | A41.4 A42.9
CCJ1P09
  Bottom 0.813: CCJ1.9 162.43,179.07 163.7,179.07 166.24,176.53 166.24,170.18 A47.10
CCJ1P11
  Bottom 0.813: CCJ1.11 161.16,180.34 163.7,180.34 164.97,180.34 167.51,177.8 167.51,173.99 A47.12
CDJ1P17
  Top 0.813: A46.3 184.66,167 184.66,183.51 A53.14 199.26,199.39 223.39,199.39 227.2,203.2 237.36,203.2 239.9,200.66 239.9,187.96 CDJ1.17
CDJ1P19
  Top 0.813: A46.5 185.93,163.19 185.93,182.88 A53.13 200.53,198.12 224.66,198.12 228.47,201.93 236.09,201.93 238.63,199.39 238.63,189.23 CDJ1.19
CDJ1P21
  Top 0.813: A46.9 187.2,160.66 187.2,182.25 A53.12 201.8,196.85 225.93,196.85 229.74,200.66 234.82,200.66 237.36,198.12 237.36,190.5 CDJ1.21
CDJ1P23
  Top 0.813: A46.11 188.47,164.47 188.47,180.97 A53.11 203.07,195.58 228.47,195.58 233.55,194.94 236.09,191.77 CDJ1.23
CDJ1P25  (via drill 0.81)
  Top 0.813: CDJ1.25 232.28,193.68 228.47,194.31 204.34,194.31 A53.10 196.72,173.99 v196.72,170.18
  Bottom 0.813: A46.13 v196.72,170.18
CDJ2P09
  Bottom 0.813: A51.10 41.78,160.02 41.78,166.37 39.24,168.91 CDJ2.9
CDJ2P11
  Bottom 0.813: A51.12 43.05,165.1 43.05,167.64 41.78,170.18 CDJ2.11
CDJ2P13
  Bottom 0.813: CDJ2.13 43.05,171.45 46.86,168.91 50.67,167.64 53.21,165.1 53.21,151.13 54.48,149.86 63.37,149.86 65.91,151.13 68.45,160.02 72.26,163.83 A49.3
CDJ2P15
  Top 0.813: CDJ2.15 36.7,173.99 43.05,173.99 46.86,177.8 A57.8
CDJ2P17
  Top 0.813: CDJ2.17 37.97,175.26 41.78,175.26 43.05,176.53 43.05,180.34 A57.10
CDJ2P19
  Top 0.813: CDJ2.19 39.24,176.53 40.51,176.53 41.78,177.8 41.78,184.15 A57.12
CDJ2P21
  Top 0.813: CDJ2.21 A57.6
CDJ2P23
  Top 0.813: CDJ2.23 A57.4
CDJ2P25
  Top 0.813: CDJ2.25 A57.2
DATA0
  Bottom 0.813: A25.3 215.77,114.3 222.12,114.3 A24.14 A23.2
DATA1
  Bottom 0.813: A25B.3 218.31,113.03 220.85,113.03 A24.13 A23.5
DATA2  (via drill 0.81)
  Top 0.813: A25C.3 208.15,105.41 v208.15,116.84 | v248.79,116.84 247.52,115.57 247.52,113.03 247.52,102.87 A23.11
  Bottom 0.813: A24.3 217.04,101.6 A25C.3 | v208.15,116.84 209.42,118.11 223.39,118.11 225.93,116.84 231.01,116.84 233.55,118.11 247.52,118.11 v248.79,116.84
DATA3  (via drill 0.81)
  Top 0.813: A25D.3 212.6,100.33 212.6,114.3 v211.96,116.84
  Bottom 0.813: A24.2 216.41,103.5 209.42,103.5 208.15,102.23 208.15,100.33 A25D.3 | v211.96,116.84 222.12,116.84 224.66,115.57 232.28,115.57 234.82,116.84 244.98,116.84 247.52,114.3 247.52,110.49 A23.14
DATA4
  Bottom 0.813: A28.14 A27.2
DATA5
  Bottom 0.813: A28.13 A27.5
DATA6  (via drill 0.81)
  Top 0.813: A27.11 164.97,105.41 164.97,110.49 163.7,114.3 v163.7,116.84
  Bottom 0.813: A28.3 140.84,109.22 140.84,111.76 143.38,114.3 148.46,114.3 149.73,115.57 161.16,118.11 162.43,118.11 v163.7,116.84
DATA7
  Bottom 0.813: A28.2 151,114.3 161.16,116.84 A27.14
DATA8
  Bottom 0.813: A33.14 32.89,114.3 A32.2
DATA9
  Bottom 0.813: A33.13 A32.5
DATA10  (via drill 0.81)
  Top 0.813: A32.11 43.05,105.41 v43.05,118.11
  Bottom 0.813: A33.3 16.38,111.76 16.38,114.3 20.19,118.11 v43.05,118.11
DATA11
  Bottom 0.813: A33.2 25.27,116.84 40.51,116.84 A32.14
DRIVE_HDATA  (via drill 0.81)
  Top 0.813: v100.2,148.59 100.2,149.86 95.12,154.94 v95.12,180.34
  Bottom 0.813: v100.2,148.59 111.63,148.59 120.52,152.4 128.14,152.4 137.03,148.59 139.57,148.59 | A39.9 A39.5 A39.11 A39.3 139.57,139.7 139.57,148.59 | 139.57,148.59 166.24,148.59 170.05,147.32 177.67,147.32 189.1,149.86 190.37,149.86 203.07,152.4 211.96,149.86 215.77,142.24 A35.3 A35.11 A35.5 A35.9 | A55.11 90.04,186.69 95.12,181.61 v95.12,180.34
DRIVE_HMA  (via drill 0.81)
  Top 0.813: v196.72,106.68 197.99,105.41 197.99,100.33 196.72,99.06 v196.72,71.12 v196.72,58.42
  Bottom 0.813: A1.6 A1.8 A1.6 | A5.11 A5.3 | A5.11 A5.6 A5.8 | A5.11 A4.2 190.37,58.42 v196.72,58.42 233.55,58.42 241.17,50.8 A1.3 A1.11 A1.6 | v196.72,106.68 A26.12 | v196.72,71.12 A15.9
DRIVE_LDATA  (via drill 0.81)
  Top 0.813: v97.66,148.59 97.66,149.86 92.58,154.94 v92.58,179.07
  Bottom 0.813: A44.9 A44.5 A44.11 A44.3 16.38,137.16 16.38,144.78 18.92,147.32 26.54,147.32 41.78,143.51 54.48,143.51 69.72,148.59 v97.66,148.59 | A55.8 87.5,177.8 90.04,177.8 v92.58,179.07
DRIVE_LMA  (via drill 0.81)
  Top 0.813: v64.64,55.88 63.37,58.42 v63.37,72.39 63.37,73.66 62.1,85.09 v62.1,132.08 | v90.04,57.15 A20.8 | v120.52,58.42 121.16,69.85 121.16,86.36 124.33,99.06 124.33,104.14 A29.4 | A15.5 186.56,72.39 v186.56,57.15 | A29.11 125.6,110.49 v125.6,115.57 | v105.28,116.84 105.28,133.35 A41.12
  Bottom 0.813: v186.56,57.15 184.02,58.42 v120.52,58.42 112.9,58.42 110.36,59.69 96.39,59.69 93.85,57.15 v90.04,57.15 84.96,57.15 82.42,54.61 79.88,54.61 77.34,57.15 67.18,57.15 v64.64,55.88 48.13,57.15 46.86,58.42 A10.3 A10.11 A10.6 A10.8 | v63.37,72.39 A20.6 | v62.1,132.08 A42.6 | A29.4 A29.11 | v105.28,116.84 124.33,116.84 v125.6,115.57 | A41.12 A40.2
END_DMA
  Top 0.813: A41.8 109.09,118.11 106.55,114.3 A30.3
  Bottom 0.813: A30.3 104.01,107.95 A30.11
GND  (via drill 0.81)
  Top 0.813: v262.76,24.13 v255.14,16.51 | U$2.AF2 244.98,8.26 v244.98,16.51 v244.98,25.4 | U$2.AT2 213.23,8.26 v213.23,16.51 v215.77,25.4 | U$2.AN2 225.93,8.26 v225.93,16.51 v225.93,25.4 | C2.2 237.36,26.67 v237.36,39.37 237.36,52.07 239.9,67.31 | 239.9,67.31 A12.8 | 200.53,69.85 A14.7 | 200.53,69.85 A25D.1 | U$2.BC1 185.29,8.26 v185.29,16.51 187.83,16.51 190.37,19.05 190.37,22.86 C5.2 182.75,30.48 182.75,31.75 181.48,40.64 | C6.2 166.24,26.67 156.08,36.83 v156.08,40.64 156.08,53.34 A16.8 158.62,69.85 158.62,86.36 A27.8 | U$2.BT2 143.38,8.26 v143.38,16.51 v143.38,25.4 | U$2.BN2 156.08,8.26 156.08,15.24 v154.81,16.51 154.81,20.32 151,24.13 v151,25.4 | A17.8 A6.1 | C14.2 v10.03,55.88 v10.03,67.31 10.03,88.9 v13.84,124.46 13.84,133.35 15.11,138.43 C26.2 v31.62,151.13 | U$2.DT2 10.03,8.26 v10.03,16.51 v10.03,25.4 | U$2.DN2 22.73,8.26 v22.73,16.51 v22.73,25.4 | U$2.DF2 41.78,8.26 v41.78,16.51 v41.78,25.4 | U$2.DC1 51.94,8.26 v51.94,16.51 v51.94,25.4 | U$2.CT2 79.88,8.26 v79.88,16.51 82.42,19.05 82.42,22.86 C10.2 74.8,39.37 74.8,41.91 | U$2.CF2 111.63,8.26 v111.63,16.51 v111.63,25.4 | U$2.CC1 121.79,8.26 v121.79,16.51 v123.06,25.4 | C3.2 214.5,39.37 v214.5,55.88 214.5,93.98 216.41,97.79 216.41,129.54 215.77,134.62 v217.04,135.89 217.04,139.7 C16.2 222.12,152.4 CDJ1.2 | C4.2 194.18,26.67 197.99,30.48 197.99,58.42 200.53,60.96 200.53,69.85 | C13.2 34.16,27.94 v34.16,40.64 34.16,48.26 36.07,50.16 36.07,54.61 36.7,55.88 36.7,58.42 A21.8 36.7,69.85 36.7,92.71 39.24,95.25 A32.8 35.43,100.33 35.43,101.6 34.16,104.14 34.16,118.11 A43.7 37.97,125.73 32.89,137.16 v31.62,151.13
  Top 0.813: A11.1 A22.8 | A45.7 v242.44,147.32 242.44,143.51 239.9,139.7 239.9,128.27 A34.7 | 74.8,41.91 A9.6 | 74.8,46.99 74.8,41.91 | 74.8,46.99 A9.4 A9.10 | 74.8,54.61 74.8,46.99 | 74.8,54.61 A9.1 A9.12 | 74.8,69.85 A20.7 | 74.8,69.85 74.8,54.61 | 74.8,69.85 74.8,85.09 77.34,99.06 | 77.34,99.06 A31.7 | 77.34,127 77.34,99.06 | 77.34,127 A42.7 | 77.34,127 A49.7 74.8,156.21 74.8,179.07 | C23.2 74.8,194.31 74.8,179.07 | A55.7 74.8,179.07 | C11.2 57.02,34.29 57.02,129.54 55.75,131.44 55.75,149.86 53.21,152.4 53.21,167.64 | C25.2 31.62,194.31 CDJ2.26 | C9.2 95.12,26.67 96.39,30.48 96.39,40.64 | 96.39,40.64 A8.7 | C8.2 102.74,26.67 102.74,30.48 110.36,38.1 116.71,52.07 116.71,55.88 | C7.2 131.95,25.4 134.49,27.94 v134.49,67.31 133.22,68.58 133.22,88.9 138.3,93.98 v138.3,125.73 138.3,139.7 C20.2 144.65,154.94 CCJ1.2 151,158.75 156.08,158.75 | A44.7 A33.1 | v31.62,151.13 26.54,153.67 26.54,156.21 29.08,158.75 CDJ2.2 | C24.2 53.21,194.31 53.21,179.07 | 53.21,179.07 A56.7 | 53.21,167.64 A50.1 | 53.21,167.64 53.21,179.07 | C22.2 96.39,194.31 96.39,179.07 | 96.39,179.07 A54.7 | 119.25,99.06 A29.7 | 119.25,99.06 119.25,115.57 A40.7 124.97,131.44 124.97,147.32 C21.2 | 116.71,55.88 A7.1 | 116.71,55.88 116.71,69.85 | 116.71,69.85 A18.7 | 116.71,69.85 116.71,86.36 119.25,99.06 | 98.93,99.06 96.39,93.98 96.39,69.85 | 98.93,99.06 A30.7 | 96.39,69.85 A19.7 | 96.39,40.64 96.39,69.85 | 98.93,99.06 98.93,116.84 A41.7 98.93,129.54 98.93,143.51 101.47,146.05 101.47,152.4 A48.7 96.39,157.48 96.39,179.07 | A39.7 A28.1 | A23.8 236.09,101.6 236.09,111.76 234.82,113.03 v234.82,123.19 | C18.2 180.21,195.58 180.21,177.8 | 180.21,177.8 A53.8 | 180.21,154.94 A46.7
  Top 0.813: 180.21,154.94 180.21,177.8 | A35.7 A24.1 | 181.48,96.52 A26.7 | 181.48,96.52 181.48,114.3 184.02,118.11 A37.7 181.48,130.81 181.48,149.86 180.21,153.67 180.21,154.94 | A27.8 156.08,101.6 156.08,123.19 A38.7 156.08,133.35 156.08,158.75 | 156.08,158.75 v156.08,162.56 156.08,166.37 159.89,177.8 159.89,181.61 | 159.89,181.61 CCJ1.17 | 159.89,181.61 162.43,181.61 C19.2 | A27.8 167.51,91.44 167.51,88.9 166.24,87.63 166.24,85.09 A16.15 | 181.48,69.85 181.48,96.52 | 181.48,69.85 A15.7 | A25.1 200.53,116.84 203.07,119.38 A36.7 | A2.1 A13.8 | A23.8 239.9,92.71 239.9,67.31 | A23.8 247.52,86.36 247.52,83.82 A12.15 | 181.48,40.64 181.48,69.85 | 181.48,40.64 A4.7
  Bottom 0.813: U$2.DT2 10.03,8.26 v10.03,16.51 | U$2.DN2 22.73,8.26 v22.73,16.51 | U$2.DF2 41.78,8.26 v41.78,16.51 | U$2.DC1 51.94,8.26 v51.94,16.51 | U$2.CT2 79.88,8.26 v79.88,16.51 | C14.2 v10.03,25.4 v22.73,25.4 C13.2 v41.78,25.4 v51.94,25.4 C12.2 C11.2 C10.2 C9.2 C8.2 v111.63,25.4 v123.06,25.4 C7.2 v143.38,25.4 v151,25.4 C6.2 C5.2 C4.2 C3.2 v215.77,25.4 v225.93,25.4 C2.2 v244.98,25.4 C1.2 261.49,25.4 v262.76,24.13 | U$2.AC2 255.14,8.26 v255.14,16.51 | U$2.AT2 213.23,8.26 v213.23,16.51 | U$2.AN2 225.93,8.26 v225.93,16.51 | U$2.AF2 244.98,8.26 v244.98,16.51 | U$2.BC1 185.29,8.26 v185.29,16.51 | U$2.BT2 143.38,8.26 v143.38,16.51 | U$2.BN2 156.08,8.26 156.08,15.24 v154.81,16.51 | U$2.CF2 111.63,8.26 v111.63,16.51 | U$2.CC1 121.79,8.26 v121.79,16.51 | A1.7 241.17,39.37 v237.36,39.37 | v214.5,55.88 A2.1 | A7.6 A7.10 A7.4 A7.12 A7.1 | v34.16,40.64 A10.7 | v10.03,55.88 A11.1 | v10.03,67.31 A22.8 24,67.31 | CDJ2.2 CDJ2.4 CDJ2.6 CDJ2.8 CDJ2.10 CDJ2.12 CDJ2.14 CDJ2.16 CDJ2.18 CDJ2.20 CDJ2.22 CDJ2.24 CDJ2.26 31.62,194.31 34.16,191.77 34.16,184.15 A57.7 | CCJ1.2 CCJ1.4 CCJ1.6 CCJ1.8 CCJ1.10 CCJ1.12 CCJ1.14 CCJ1.16 CCJ1.18 CCJ1.20 CCJ1.22 CCJ1.24 CCJ1.26 | CDJ1.2 CDJ1.4 CDJ1.6 CDJ1.8 CDJ1.10 CDJ1.12 CDJ1.14 CDJ1.16 CDJ1.18 CDJ1.20 CDJ1.22 CDJ1.24 CDJ1.26 228.47,196.85 228.47,199.39 229.74,200.66 C15.2 247.52,199.39 247.52,182.88 A52.7 | A25.1 A25B.1 A25C.1 A25D.1 | A16.5 163.7,72.39 163.7,69.85 A16.8 | 227.2,67.31 A13.9 | A13.8 227.2,67.31 | A13.2 A13.3 227.2,77.47 227.2,67.31 | v156.08,40.64 A5.7 | 145.92,67.31 A17.9 | 145.92,67.31 A17.8 v134.49,67.31 | 145.92,67.31 145.92,77.47 A17.3 A17.2 | A21.8 41.78,69.85 41.78,74.93
  Bottom 0.813: 41.78,82.55 A21.2 | 41.78,82.55 A21.15 | 41.78,74.93 41.78,82.55 | 41.78,74.93 A21.5 | v13.84,124.46 A44.7 | v234.82,123.19 A34.7 | v138.3,125.73 A39.7 | A35.7 217.04,129.54 v217.04,135.89 | C17.2 205.61,146.05 205.61,130.81 A36.7 | C16.2 225.93,148.59 v242.44,147.32 | v156.08,162.56 A47.7 | v31.62,151.13 A51.7 | A50.1 A50.12 60.83,160.02 A50.10 | 24,67.31 A22.9 | A22.2 A22.3 24,77.47 24,67.31
  pour Bottom: 264.03,25.4 264.03,22.86 1.14,22.86 1.14,25.4
INITIALIZE
  Top 0.813: U$2.CR1 86.23,8.26 86.23,21.59 79.88,36.83 A9.7
INT_STROBE  (via drill 0.81)
  Top 0.813: v171.32,38.1 172.59,38.1 180.21,30.48 180.21,27.94 182.75,25.4 v182.75,16.51
  Bottom 0.813: U$2.BD2 181.48,8.26 181.48,15.24 v182.75,16.51 | A7.9 142.11,38.1 v171.32,38.1
INTSTROBE  (via drill 0.81)
  Top 0.813: v130.68,55.88 130.68,90.17 134.49,93.98 134.49,113.03 v137.03,115.57
  Bottom 0.813: A26.3 186.56,109.22 186.56,111.76 184.02,114.3 176.4,115.57 163.7,119.38 161.16,119.38 149.73,116.84 148.46,116.84 147.19,116.84 v137.03,115.57 | v130.68,55.88 A7.14
IO_PAUSE  (via drill 0.81)
  Top 0.813: v62.1,134.62 63.37,133.35 63.37,85.09 64.64,73.66 v64.64,68.58 | v81.15,66.04 79.88,63.5 79.88,55.88 A9.13
  Bottom 0.813: v62.1,134.62 A42.5 | v64.64,68.58 70.99,66.04 v81.15,66.04 83.69,67.31 114.17,67.31 116.71,69.85 116.71,74.93 A18.4 A18.3 A18.2
IOT76X
  Bottom 0.813: A54.6 95.12,185.42 95.12,191.77 90.04,193.04 84.96,196.85 69.72,196.85 A56.13
IOT77X
  Bottom 0.813: A54.3 96.39,191.77 96.39,193.04 95.12,194.31 91.31,194.31 86.23,198.12 68.45,198.12 65.91,196.85 62.1,196.85 59.56,194.31 59.56,187.96 A56.5
IOTP4
  Bottom 0.813: CDJ1.15 243.71,177.8 246.25,177.8 248.79,180.34 248.79,186.69 A52.12
LATCH_MD  (via drill 0.81)
  Top 0.813: A13.10 234.82,67.31 v234.82,62.23 | v29.08,59.69 31.62,63.5 31.62,67.31 A22.10 | v126.87,62.23 124.97,68.58 124.97,85.09 A29.8 | A17.10 153.54,67.31 v152.27,62.23
  Bottom 0.813: v29.08,59.69 34.16,63.5 35.43,62.23 v126.87,62.23 v152.27,62.23 v234.82,62.23
MALC  (via drill 0.81)
  Top 0.813: v195.45,102.87 195.45,107.95 196.72,109.22 v196.72,114.3 v196.72,123.19 | v177.67,116.84 177.67,72.39 180.21,68.58 v180.21,43.18
  Bottom 0.813: A26.9 v195.45,102.87 | v196.72,114.3 v177.67,116.84 | v196.72,123.19 206.88,123.19 213.23,124.46 215.77,124.46 219.58,121.92 231.01,121.92 A34.3 | v180.21,43.18 A4.6 A4.5
MD00  (via drill 0.81)
  Top 0.813: A2.14 232.28,60.96 229.74,63.5 229.74,77.47 | 229.74,77.47 A13.4 | v233.55,109.22 233.55,99.06 234.82,97.79 234.82,91.44 229.74,86.36 229.74,77.47
  Bottom 0.813: v233.55,109.22 A23.3
MD01  (via drill 0.81)
  Top 0.813: A2.13 229.74,55.88 229.74,60.96 228.47,62.23 228.47,71.12 A13.5 222.12,77.47 222.12,85.09 224.66,87.63 233.55,92.71 233.55,96.52 232.28,97.79 v232.28,100.33
  Bottom 0.813: v232.28,100.33 A23.6
MD02  (via drill 0.81)
  Top 0.813: A2.3 227.2,53.34 v227.2,63.5 227.2,69.85 A13.6 | v253.87,86.36 v253.87,100.33
  Bottom 0.813: v253.87,100.33 A23.10 | v253.87,86.36 255.14,83.82 255.14,68.58 248.79,63.5 v227.2,63.5
MD03  (via drill 0.81)
  Top 0.813: A2.2 222.12,55.88 222.12,69.85 | 222.12,69.85 222.12,74.93 220.85,76.2 220.85,86.36 223.39,88.9 v232.28,93.98 | A13.7 222.12,69.85 | v253.87,107.95 255.14,105.41 v255.14,96.52
  Bottom 0.813: A13.7 222.12,72.39 217.04,86.36 213.23,88.9 196.72,88.9 194.18,87.63 167.51,87.63 164.97,88.9 157.35,88.9 147.19,87.63 124.33,87.63 A18.1 | v232.28,93.98 233.55,92.71 251.33,92.71 v255.14,96.52 | v253.87,107.95 A23.13
MD04  (via drill 0.81)
  Top 0.813: A6.14 149.73,57.15 149.73,63.5 148.46,64.77 148.46,77.47 | 148.46,77.47 A17.4 | v153.54,110.49 153.54,99.69 156.08,97.16 156.08,91.44 152.27,87.63 149.73,87.63 148.46,86.36 148.46,77.47
  Bottom 0.813: A17.4 A18.12 | v153.54,110.49 A27.3
MD05  (via drill 0.81)
  Top 0.813: A6.13 148.46,55.88 148.46,62.23 147.19,63.5 147.19,71.12 A17.5 140.84,77.47 140.84,85.09 144.65,88.9 151,88.9 154.81,92.71 154.81,96.52 v153.54,97.79
  Bottom 0.813: A17.5 A18.11 | A27.6 v153.54,97.79
MD06  (via drill 0.81)
  Top 0.813: A6.3 145.92,53.34 v145.92,64.77 145.92,69.85 A17.6 | v175.13,69.85 175.13,81.28 172.59,83.82 v172.59,101.6
  Bottom 0.813: v145.92,64.77 156.08,64.77 158.62,63.5 168.78,63.5 v175.13,69.85 | v172.59,101.6 A27.10 | A18.5 A18.10 A17.6
MD07  (via drill 0.81)
  Top 0.813: A6.2 140.84,55.88 140.84,69.85 | 140.84,69.85 A17.7 | 140.84,69.85 140.84,73.66 139.57,74.93 139.57,85.72 144.02,90.17 149.73,90.17 v153.54,93.98 | v172.59,109.22 172.59,104.14 173.86,102.87 v173.86,95.25
  Bottom 0.813: A18.6 A18.9 A17.7 | v173.86,95.25 168.78,93.98 v153.54,93.98 | v172.59,109.22 A27.13
MD08  (via drill 0.81)
  Top 0.813: A11.14 26.54,58.42 26.54,72.39 A22.4 26.54,82.55 26.54,86.36 32.89,92.71 32.89,99.06 30.35,104.14 v30.35,111.76 | A48.11 102.74,166.37 102.74,190.5 A54.1
  Bottom 0.813: A22.4 11.3,87.63 11.3,127 16.38,152.4 | A57.5 35.43,187.96 35.43,193.04 31.62,200.66 27.81,200.66 25.27,193.04 16.38,152.4 | 16.38,152.4 22.73,149.86 32.89,147.32 44.32,144.78 53.21,144.78 68.45,149.86 76.07,149.86 79.88,151.13 100.2,151.13 102.74,153.67 102.74,158.75 A48.11 | v30.35,111.76 A32.3
MD08L
  Top 0.813: A48.10 101.47,165.1 101.47,184.15 A54.4
MD09  (via drill 0.81)
  Top 0.813: v30.35,100.33 30.35,93.98 27.81,91.44 21.46,87.63 18.92,85.09 18.92,78.74 A22.5 25.27,71.12 25.27,57.15 A11.13 | A57.3 44.32,194.31 44.32,196.85 45.59,200.66 46.86,201.93 48.13,201.93 50.67,199.39 v50.67,187.96 | A55.1 80.52,191.13 80.52,155.57 v81.15,154.94
  Bottom 0.406: v81.15,154.94 83.69,152.4 98.93,152.4 101.47,154.94 101.47,162.56 A48.13
  Bottom 0.813: v30.35,100.33 A32.6 | A22.5 10.03,86.36 10.03,128.27 15.11,152.4 24,193.04 26.54,201.93 32.89,201.93 36.7,194.31 36.7,191.77 A57.3 | v50.67,187.96 53.21,185.42 53.21,177.8 54.48,176.53 63.37,176.53 65.91,177.8 67.18,182.88 68.45,191.77 70.99,194.31 A55.1
MD09L  (via drill 0.81)
  Top 0.813: A48.12 104.01,167.64 v104.01,194.31
  Bottom 0.813: v104.01,194.31 101.47,196.85 91.31,196.85 87.5,199.39 87.5,200.66 84.96,203.2 77.34,203.2 72.26,199.39 67.18,199.39 64.64,198.12 60.83,198.12 A56.1 58.29,191.77 58.29,189.23 A56.4
MD10  (via drill 0.81)
  Top 0.813: A11.3 24,53.34 v24,62.23 24,69.85 A22.6 | v35.43,64.77 35.43,93.98 v36.7,95.25 | A57.1 40.51,194.31 43.05,196.85 44.32,201.93 45.59,203.2 59.56,203.2 60.83,201.93 60.83,194.31 A56.3
  Bottom 0.813: v24,62.23 30.35,64.77 v35.43,64.77 | A22.6 8.76,85.09 8.76,129.54 22.73,193.04 25.27,203.2 35.43,203.2 A57.1 | A32.10 40.51,93.98 37.97,93.98 v36.7,95.25
MD11  (via drill 0.81)
  Top 0.813: A11.2 18.92,55.88 18.92,69.85 | 18.92,69.85 18.92,74.93 17.65,77.47 17.65,86.36 20.19,88.9 v25.27,92.71 | 18.92,69.85 A22.7
  Bottom 0.813: A32.13 49.4,104.14 49.4,96.52 46.86,93.98 43.05,93.98 41.78,92.71 v25.27,92.71 | A22.7 7.49,83.82 7.49,130.81 21.46,193.04 24,204.47 40.51,204.47 44.32,199.39 44.32,194.31 A57.13 A56.2
MD/!DATA  (via drill 0.81)
  Top 0.813: v78.61,92.71 83.69,97.79 83.69,115.57 84.96,116.84 84.96,132.08 A42.11 | v184.02,91.44 186.56,93.98 186.56,101.6 189.1,113.03 194.18,130.81 194.18,133.35 A37.11 | v170.05,90.17 170.05,91.44 163.7,97.79 163.7,109.22 162.43,113.03 A27.1 | v247.52,91.44 244.98,93.98 244.98,110.49 A23.1 | A32.1 41.78,111.76 41.78,100.33 44.32,97.79 v44.32,92.71
  Bottom 0.813: v247.52,91.44 v184.02,91.44 v170.05,90.17 167.51,91.44 87.5,91.44 v78.61,92.71 v44.32,92.71
MUX00
  Top 0.813: A23.4 238.63,109.22 238.63,113.03 238.63,114.3 238.63,134.62 237.36,135.89 237.36,144.78 238.63,147.32 238.63,154.94 241.17,161.29 241.17,168.91 242.44,170.18 242.44,193.04 A52.1
MUX01  (via drill 0.81)
  Top 0.813: A23.7 237.36,102.87 237.36,133.35 236.09,134.62 236.09,146.05 237.36,148.59 237.36,156.21 239.9,162.56 239.9,170.18 241.17,171.45 v241.17,185.42
  Bottom 0.813: A52.3 243.71,190.5 v241.17,185.42
MUX02  (via drill 0.81)
  Top 0.813: v255.14,152.4 255.14,180.34 A52.9
  Bottom 0.813: A23.9 256.41,100.33 260.22,142.24 v255.14,152.4
MUX03  (via drill 0.81)
  Top 0.813: v239.9,181.61 239.9,172.72 238.63,171.45 238.63,163.83 236.09,157.48 236.09,149.86 234.82,147.32 234.82,133.35 236.09,132.08 v236.09,115.57
  Bottom 0.813: A23.12 244.98,107.95 244.98,113.03 242.44,115.57 v236.09,115.57 | v239.9,181.61 A52.5
MUX04
  Top 0.813: A27.4 158.62,109.22 158.62,119.38 164.97,125.73 164.97,128.27 164.34,143.51 166.24,161.29 166.24,172.72 A47.1
MUX05
  Top 0.813: A27.7 157.35,102.87 157.35,120.65 163.7,127 163.7,128.27 163.07,143.51 164.97,161.29 164.97,168.91 A47.3
MUX06  (via drill 0.81)
  Top 0.813: v173.86,105.41 v173.86,161.29
  Bottom 0.813: v173.86,161.29 A47.9 | A27.9 175.13,101.6 175.13,104.14 v173.86,105.41
MUX07  (via drill 0.81)
  Top 0.813: v167.51,163.83 167.51,161.29 165.61,143.51 166.24,128.27 166.24,125.73 164.97,116.84 164.97,115.57 166.24,111.76 166.24,106.68 A27.12
  Bottom 0.813: v167.51,163.83 A47.5
MUX08
  Top 0.813: A51.1 43.05,162.56 43.05,151.13 42.42,140.97 42.42,139.7 43.05,123.19 43.05,120.65 36.7,114.3 36.7,109.22 A32.4
MUX09
  Top 0.813: A51.3 41.78,158.75 41.78,151.13 41.15,140.97 41.15,139.7 41.78,123.19 41.78,121.92 35.43,115.57 35.43,105.41 37.97,100.33 A32.7
MUX10  (via drill 0.81)
  Top 0.813: v46.86,87.63 A32.9 | v49.4,85.09 50.67,86.36 v50.67,147.32
  Bottom 0.813: v49.4,85.09 v46.86,87.63 | A51.9 50.67,151.13 v50.67,147.32
MUX11  (via drill 0.81)
  Top 0.813: v44.32,154.94 44.32,151.13 43.69,140.97 43.69,139.7 44.32,124.46 44.32,115.57 44.32,106.68 A32.12
  Bottom 0.813: v44.32,154.94 A51.5
MY_DMA  (via drill 0.81)
  Top 0.406: v197.99,125.73 197.99,108.58 199.26,107.31 201.17,107.31 202.44,106.05 202.44,100.33 201.8,99.69 199.9,99.69 197.99,97.79 v197.99,80.01
  Bottom 0.813: A41.5 A41.10 120.52,125.73 130.68,125.73 137.03,123.19 144.65,123.19 161.16,125.73 173.86,125.73 182.75,124.46 185.29,124.46 187.83,124.46 A37.8 v197.99,125.73 | A15.2 A15.12 v197.99,80.01
MY_IOT  (via drill 0.81)
  Top 0.813: v90.04,34.29 92.58,39.37 v92.58,45.72 | v54.48,35.56 55.75,38.1 v55.75,124.46 55.75,128.27 54.48,130.81 54.48,148.59 51.94,151.13 51.94,162.56 v50.67,163.83 v50.67,182.88 | A8.5 A8.6
  Bottom 0.813: v54.48,35.56 76.07,34.29 v90.04,34.29 | A43.8 v55.75,124.46 57.02,137.16 59.56,139.7 79.88,144.78 87.5,144.78 90.04,142.24 A41.1 | v50.67,163.83 A51.13 | v50.67,182.88 50.67,176.53 53.21,173.99 77.34,176.53 79.88,176.53 | 79.88,176.53 100.2,176.53 102.74,179.07 102.74,184.15 | 102.74,184.15 A54.5 | A54.2 102.74,187.96 102.74,184.15 | A55.2 79.88,189.23 79.88,176.53 | v92.58,45.72 A8.5
N$2
  Top 0.813: A12.9 253.87,59.69 253.87,46.99 A1.9
N$5